# EAGLE design Hatch2023Trophy_1 (EAGLE 9.6.2)

## Sheet 1 of 2
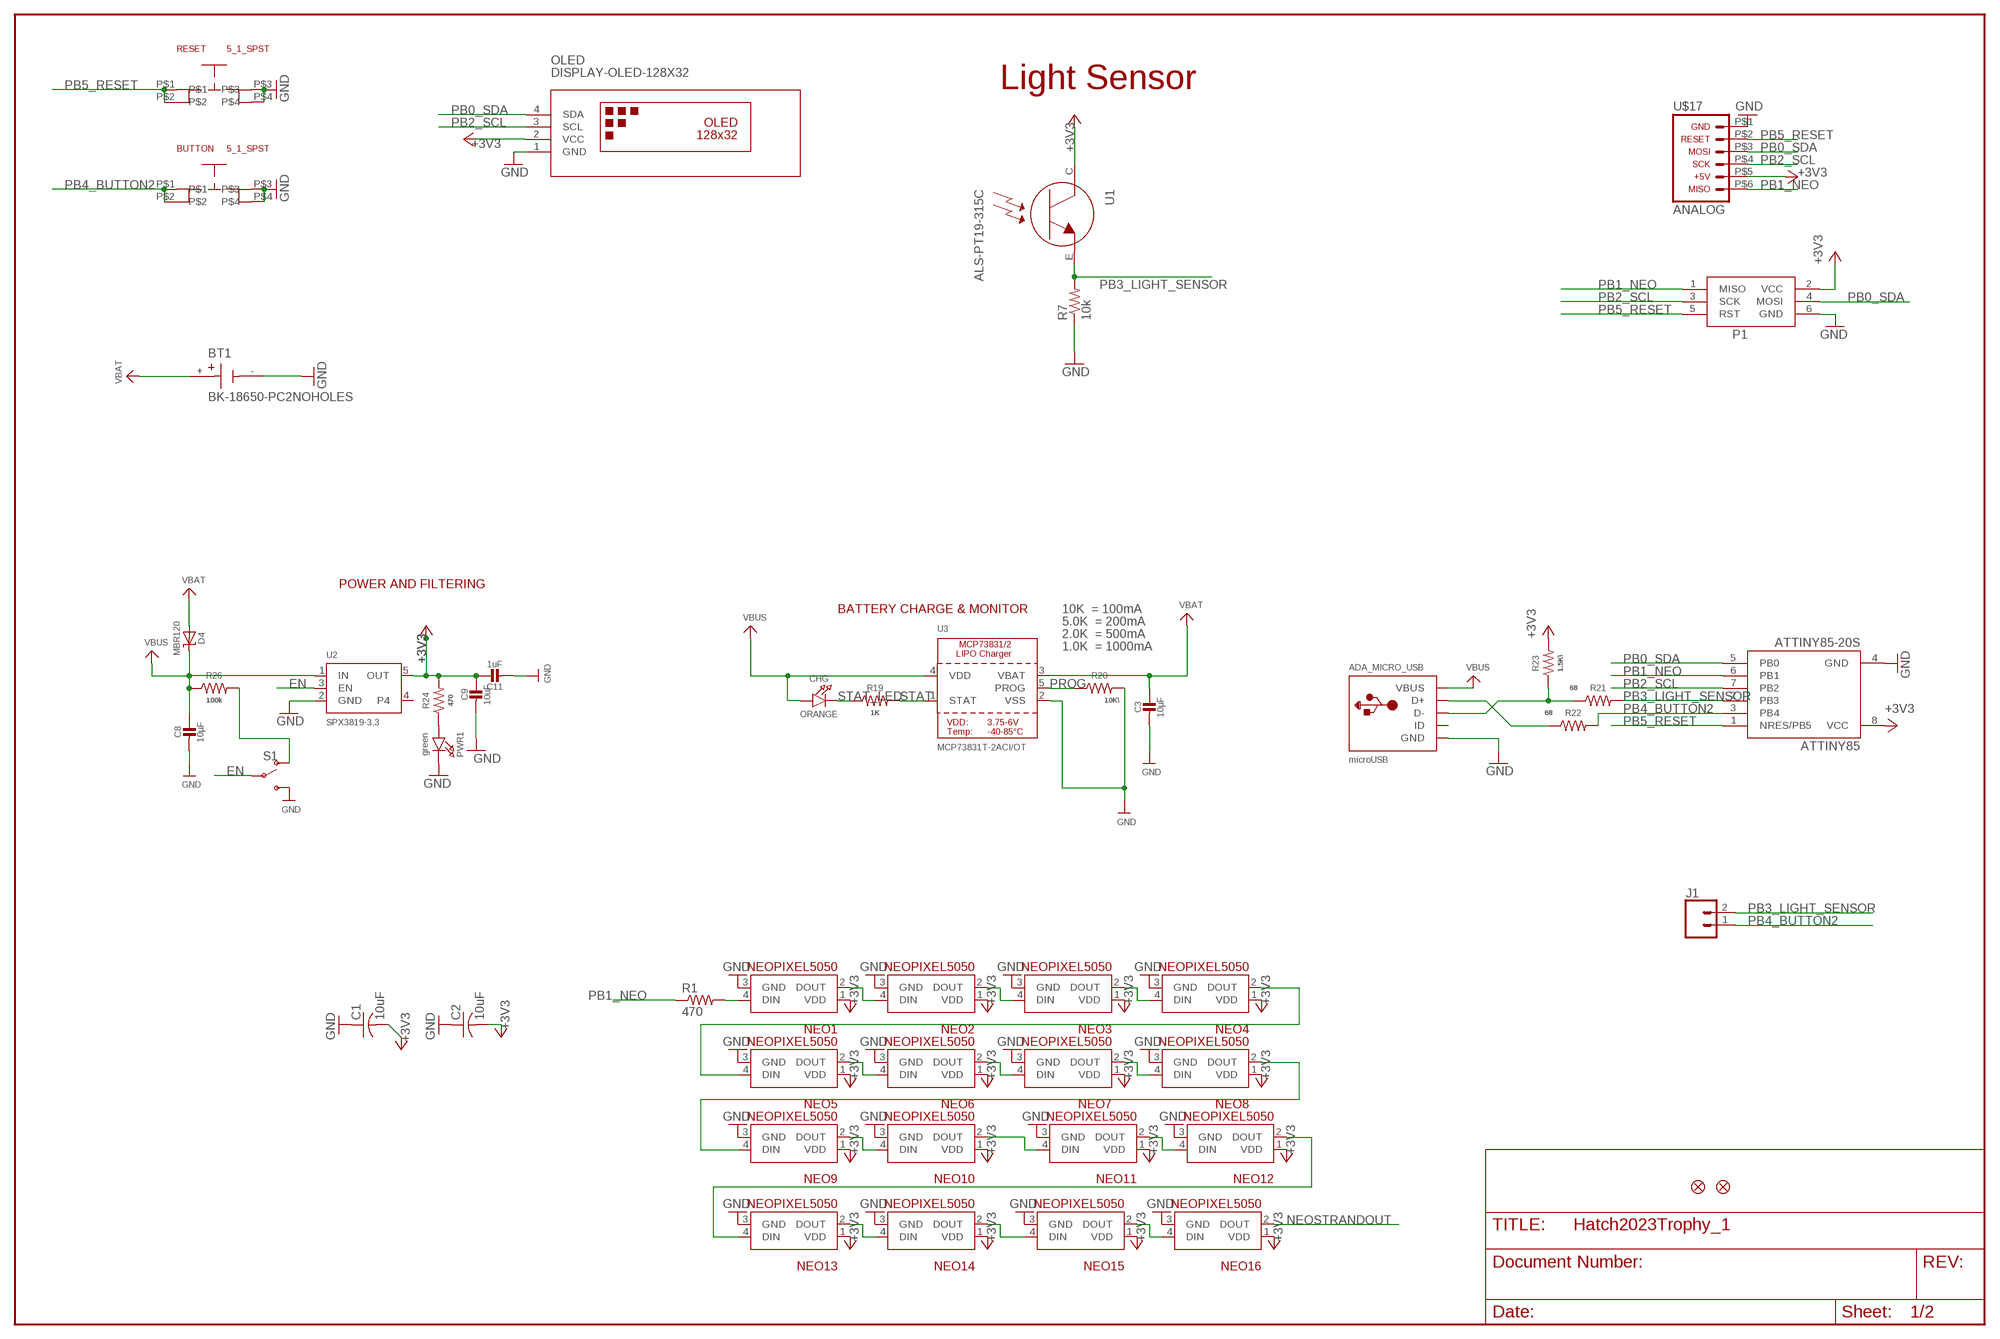
[diagram p0: schematic, sheet 1]

### Parts
ADA_MICRO_USB  microUSB  USB_MICRO_20329_V2  [4UCONN_20329_V2]
ATTINY85  ATTINY85-20S  [SOIC8_EIAJ_208MIL]
BT1  BK-18650-PC2NOHOLES  [BAT_BK-18650-PC2_NOHOLES]
BUTTON  5_1_SPST  [5_1_SPST]
C1  10uF  C-USC0805  [C0805]
C2  10uF  C-USC0805  [C0805]
C3  10µF  CAP_CERAMIC0805-NOOUTLINE  [0805-NO@1]
C8  10µF  CAP_CERAMIC0805-NOOUTLINE  [0805-NO@1]
C9  10uF  CAP_CERAMIC0805-NOOUTLINE  [0805-NO@1]
C11  1uF  CAP_CERAMIC0805-NOOUTLINE  [0805-NO@1]
CHG  ORANGE  LED0805_NOOUTLINE  [CHIPLED_0805_NOOUTLINE]
D4  MBR120  DIODE-SCHOTTKYSOD-123  [SOD-123]
J1  CONN_02  [1X02]
NEO1  NEOPIXEL5050  [NEOPIXEL5050]
NEO2  NEOPIXEL5050  [NEOPIXEL5050]
NEO3  NEOPIXEL5050  [NEOPIXEL5050]
NEO4  NEOPIXEL5050  [NEOPIXEL5050]
NEO5  NEOPIXEL5050  [NEOPIXEL5050]
NEO6  NEOPIXEL5050  [NEOPIXEL5050]
NEO7  NEOPIXEL5050  [NEOPIXEL5050]
NEO8  NEOPIXEL5050  [NEOPIXEL5050]
NEO9  NEOPIXEL5050  [NEOPIXEL5050]
NEO10  NEOPIXEL5050  [NEOPIXEL5050]
NEO11  NEOPIXEL5050  [NEOPIXEL5050]
NEO12  NEOPIXEL5050  [NEOPIXEL5050]
NEO13  NEOPIXEL5050  [NEOPIXEL5050]
NEO14  NEOPIXEL5050  [NEOPIXEL5050]
NEO15  NEOPIXEL5050  [NEOPIXEL5050]
NEO16  NEOPIXEL5050  [NEOPIXEL5050]
OLED  DISPLAY-OLED-128X32  [DISPLAY-OLED-128X32]
P1  AVRISP-6  [AVRISP]
PWR1  green  LED0805_NOOUTLINE  [CHIPLED_0805_NOOUTLINE]
R1  470  R-US_R0805  [R0805]
R7  10k  R-US_R0805  [R0805]
R19  1K  R-US_R0805  [R0805]
R20  10K\  R-US_R0805  [R0805]
R21  68  R-US_R0805  [R0805]
R22  68  R-US_R0805  [R0805]
R23  1.5K\  R-US_R0805  [R0805]
R24  470  R-US_R0805  [R0805]
R26  100k  R-US_R0805  [R0805]
RESET  5_1_SPST  [5_1_SPST]
S1  SWITCH-SPDT-SMD-AYZ0202  [SWITCH_DPDT_SMD_AYZ0202]
U1  ALS-PT19-315C  LIGHT_ALS-PT19-315C  [ALS-PT19-315C]
U2  SPX3819-3.3  VREG_SOT23-5  [SOT23-5]
U3  MCP73831T-2ACI/OT  MCP73831/2  [SOT23-5]
U$17  ICSP_FLATSMD_2X3  [CONN-SMD-2X3]
U$34  FIDUCIAL_1MM  [FIDUCIAL_1MM]
U$35  FIDUCIAL_1MM  [FIDUCIAL_1MM]

### Nets
+3V3 [5V]: ATTINY85.8(VCC) C1.2 C2.2 C9.1 C11.1 NEO1.1(VDD) NEO2.1(VDD) NEO3.1(VDD) NEO4.1(VDD) NEO5.1(VDD) NEO6.1(VDD) NEO7.1(VDD) NEO8.1(VDD) NEO9.1(VDD) NEO10.1(VDD) NEO11.1(VDD) NEO12.1(VDD) NEO13.1(VDD) NEO14.1(VDD) NEO15.1(VDD) NEO16.1(VDD) OLED.2(VCC) P1.2(VCC) R23.2 R24.2 U1.C U2.5(OUT) U$17.P$5
D+: ADA_MICRO_USB.D+ R22.1
D-: ADA_MICRO_USB.D- R21.1 R23.1
EN: S1.2(P) U2.3(EN)
GND [GND]: ADA_MICRO_USB.BASE@1(GND) ADA_MICRO_USB.BASE@2(GND) ADA_MICRO_USB.GND ADA_MICRO_USB.SPRT@1(GND) ADA_MICRO_USB.SPRT@2(GND) ADA_MICRO_USB.SPRT@3(GND) ADA_MICRO_USB.SPRT@4(GND) ATTINY85.4(GND) BT1.- BUTTON.P$3 BUTTON.P$4 C1.1 C2.1 C3.2 C8.2 C9.2 C11.2 NEO1.3(GND) NEO2.3(GND) NEO3.3(GND) NEO4.3(GND) NEO5.3(GND) NEO6.3(GND) NEO7.3(GND) NEO8.3(GND) NEO9.3(GND) NEO10.3(GND) NEO11.3(GND) NEO12.3(GND) NEO13.3(GND) NEO14.3(GND) NEO15.3(GND) NEO16.3(GND) OLED.1(GND) P1.6(GND) PWR1.C R7.1 R20.2 RESET.P$3 RESET.P$4 S1.3(S) U2.2(GND) U3.2(VSS) U$17.P$1
N$1: NEO13.2(DOUT) NEO14.4(DIN)
N$2: NEO11.2(DOUT) NEO12.4(DIN)
N$3: NEO12.2(DOUT) NEO13.4(DIN)
N$4: NEO14.2(DOUT) NEO15.4(DIN)
N$5: NEO15.2(DOUT) NEO16.4(DIN)
N$8: NEO4.2(DOUT) NEO5.4(DIN)
N$9: PWR1.A R24.1
N$11: R26.2 S1.1(O)
N$12: NEO1.4(DIN) R1.2
N$13: NEO8.2(DOUT) NEO9.4(DIN)
N$18: NEO1.2(DOUT) NEO2.4(DIN)
N$20: NEO2.2(DOUT) NEO3.4(DIN)
N$21: NEO3.2(DOUT) NEO4.4(DIN)
N$23: NEO5.2(DOUT) NEO6.4(DIN)
N$24: NEO6.2(DOUT) NEO7.4(DIN)
N$25: NEO7.2(DOUT) NEO8.4(DIN)
N$27: NEO9.2(DOUT) NEO10.4(DIN)
N$28: NEO10.2(DOUT) NEO11.4(DIN)
NEOSTRANDOUT: NEO16.2(DOUT)
PB0_SDA: ATTINY85.5(PB0) OLED.4(SDA) P1.4(MOSI) U$17.P$3
PB1_NEO: ATTINY85.6(PB1) P1.1(MISO) R1.1 U$17.P$6
PB2_SCL: ATTINY85.7(PB2) OLED.3(SCL) P1.3(SCK) U$17.P$4
PB3_LIGHT_SENSOR: ATTINY85.2(PB3) J1.2 R7.2 R21.2 U1.E
PB4_BUTTON2: ATTINY85.3(PB4) BUTTON.P$1 BUTTON.P$2 J1.1 R22.2
PB5_RESET: ATTINY85.1(NRES/PB5) P1.5(RST) RESET.P$1 RESET.P$2 U$17.P$2
PROG: R20.1 U3.5(PROG)
STAT: R19.2 U3.1(STAT)
STAT_LED: CHG.C R19.1
VBAT [PWR]: BT1.+ C3.1 D4.A U3.3(VBAT)
VBUS [5V]: ADA_MICRO_USB.VBUS C8.1 CHG.A D4.C R26.1 U2.1(IN) U3.4(VDD)
Unconnected: ADA_MICRO_USB.ID U2.4

### Notes on the sheet
- Light Sensor
- POWER AND FILTERING
- BATTERY CHARGE & MONITOR | 10K  = 100mA
- 5.0K  = 200mA
- 2.0K  = 500mA
- 1.0K  = 1000mA

## Sheet 2 of 2

## Library data of the parts
ADA_MICRO_USB = microbuilder:USB: USB Connectors USBMINIB - Surface Mount Female Mini-B USB Connector 4UConnector: 06564
ATTINY85 = attiny25_45_85:ATTINY85*: ATMEL ATtiny 85 Packages: P = PDIP 08 30mil S = SOIC 08 EIAJ 208mil Technologies Note: for complete ordering code (temp. range, finish, tape&reel etc.) see www.atmel.com • Supply Voltage: V = (1.8…5.5)V | [blank] = (2.7…5.5)V • Speed: 10 = 10 MHz | 20 = 20 MHz Author: Dipl.-Ing. FH Rainer Bayer HHN Hochschule Heilbronn (Heilbronn University), rainer.bayer@hs-heilbronn.de Ingenieurbüro ing-rb, mail@ing-rb.de
BT1 = BK-18650-PC2:BK-18650-PC2: Battery Holder (Open) 18650 1 Cell PC Pin Check prices <https://pricing.snapeda.com/parts/BK-18650-PC2/MPD%20%28Memory%20Protection%20Devices%29/view-part?ref=eda>
BUTTON RESET = TrophyParts:5_1_SPST
C1 C2 = rcl:C-US: CAPACITOR, American symbol; SPICEPREFIX: C
C3 C8 C9 C11 = microbuilder:CAP_CERAMIC: Ceramic Capacitors For new designs, use the packages preceded by an '_' character since they are more reliable: The following footprints should be used on most boards: _0402 - Standard footprint for regular board layouts _0603 - Standard footprint for regular board layouts _0805 - Standard footprint for regular board layouts _1206 - Standard footprint for regular board layouts For extremely tight-pitch boards where space is at a premium, the following 'micro-pitch' footprints can be used (smaller pads, no silkscreen outline, etc.): _0402MP - Micro-pitch footprint for very dense/compact boards _0603MP - Micro-pitch footprint for very dense/compact boards _0805MP - Micro-pitch footprint for very dense/compact boards _1206MP - Micro-pitch footprint for very dense/compact boards
CHG PWR1 = microbuilder:LED: LED 0603 - 0603 Surface Mount Package 2mA: Green LED - Low Power (3.9mcd, 2ma, 1.7Vf) - Digikey: 475-2709-2-ND Orange LED - Low Power (9.8mcd, 2ma, 1.8Vf) - Digikey: 475-1194-2-ND Red LED - Low Power (5mcd, 2ma, 1.8Vf) - Digikey: 475-1195-2-ND Yellow LED - Low Power (7mcd, 2ma, 1.8Vf) - Digikey: 475-1196-2-ND 5mA: Blue LED - Low Power (17mcd, 5ma, 2.9Vf) - Digikey: LNJ937W8CRACT-ND 0805 - 0805 Surface Mount Package 2mA: Red LED (8.8mcd, 2mA, 1.8Vf, Clear) - Low Power [Digikey: 475-2510-1-ND] Green LED (5mcd, 2mA, 1.8Vf, Clear) - Low Power [Digikey: 475-2730-1-ND] Yellow LED (11.3mcd, 2mA, 1.8Vf, Clear) - Low Power [Digikey: 475-2555-1-ND] 20mA: Red LED (104mcd, 20mA, Diffused) - LS R976 [Digikey: 475-1278-6-ND] Red LED (12mcd, 20mA, 2.0Vf, Clear) - APT2012EC [Digikey: 754-1128-1-ND] Green LED (15mcd, 20mA, 2.2Vf, Clear) - APT2012GC [Digikey: 754-1131-1-ND] Orange LED (160mcd, 20mA, 2.1Vf, Clear) - APT2012SECK [Digikey: 754-1130-1-ND] 1206 - 1206 Surface Mount Package Green LED (26mcd, 20mA, Diffused) - LG N971 [Digikey: 475-1407-6-ND] Red LED (15mcd, 20mA, Diffused) - LH N974 [Digikey: 475-1416-6-ND] Cree - Cree High-Power Surface Mount LEDs XPEBWT-L1-0000-00D50 - White 111lm 350mA 2.9Vf 6200K 110° XTEAWT-00-0000-00000LEE3 - White 114lm 350mA 2.85Vf 5000K 115° Everlight - Everlight 45-21 Series Surface Mount LEDs 45-21/QK2C-B2832AC2CB2/2T - Warm White 2000mcd 20mA 3.25Vf 3050K 120° 45-21/LK2C-B38452C4CB2/2T - Nuetral White 2000mcd 20mA 3.25Vf 4150K 120° 45-21/LK2C-B50634C6CB2/2T - Cold White 2200mcd 20mA 3.25Vf 5650K 120° PLCC2 Reverse Mount LS T77K-J1L2-1-0-2-R18-Z - Red 11.25mcd 2mA 1.8Vf 630nm 120° LO T77K-L1M2-24-Z - Orange 19.6mcd 2mA 1.8Vf 606nm 120° LY T77K-K2M1-26-Z - Yellow 15.7mcd 2mA 1.8Vf 587nm 120°
D4 = microbuilder:DIODE-SCHOTTKY
J1 = SparkFun-Connectors:CONN_02: Multi connection point. Often used as Generic Header-pin footprint for 0.1 inch spaced/style header connections On any of the 0.1 inch spaced packages, you can populate with these: Break Away Headers - Straight <https://www.sparkfun.com/products/116> (PRT-00116) Break Away Male Headers - Right Angle <https://www.sparkfun.com/products/553> (PRT-00553) Female Headers <https://www.sparkfun.com/products/115> (PRT-00115) Break Away Headers - Machine Pin <https://www.sparkfun.com/products/117> (PRT-00117) Break Away Female Headers - Swiss Machine Pin <https://www.sparkfun.com/products/743> (PRT-00743) For SCREWTERMINALS and SPRING TERMINALS visit here: Screw Terimnals on SparkFun.com <https://www.sparkfun.com/search/results?term=Screw+Terminals> (5mm/3.5mm/2.54mm spacing) This device is also useful as a general connection point to wire up your design to another part of your project. Our various solder wires solder well into these plated through hole pads. Hook-Up Wire - Assortment (Stranded, 22 AWG) <https://www.sparkfun.com/products/11375> (PRT-11375) Hook-Up Wire - Assortment (Solid Core, 22 AWG) <https://www.sparkfun.com/products/11367> (PRT-11367) View the entire wire category on our website here <https://www.sparkfun.com/categories/141> Special notes: Molex polarized connector foot print use with: PRT-08233 with associated crimp pins and housings. 2.54_SCREWTERM for use with PRT-10571. 3.5mm Screw Terminal footprints for PRT-08084 5mm Screw Terminal footprints for use with PRT-08432
NEO1-NEO16 = TrophyParts:NEOPIXEL5050
OLED = Hatch2020:DISPLAY-OLED-128X32: 128x32 Dot Matrix OLED Module with I2C interface based on SSD1306 chip More details available here: http://www.tinyosshop.com/index.php?route=product/product&product_id=953 Schematic available here: http://www.tinyosshop.com/datasheet/OLED%2012832.pdf SSD1306 datasheet: https://cdn-shop.adafruit.com/datasheets/SSD1306.pdf Click here to find device on ebay.com <http://www.ebay.com/sch/oled+display+128x32+i2c>
P1 = adafruit:AVRISP: AVR ISP HEADER Standard 6 pin header for AVR programming
R1 R7 R19-R24 R26 = rcl:R-US_: RESISTOR, American symbol; SPICEPREFIX: R
S1 = SparkFun-Switches:SWITCH-SPDT: Single Pole, Double Throw (SPDT) Switch Single-pole, double-throw (SPDT) switch. Variant Overview SMD-AYZ0202 Surface Mount DPDT Switch <https://www.sparkfun.com/products/597> (COM-00597) Used on e.g. LilyPad Arduino USB - ATmega32U4 Board <https://www.sparkfun.com/products/12049> PTH-11.6X4.0MM SPDT Mini Power Switch <https://www.sparkfun.com/products/102> (COM-00102) Used on e.g. SparkFun Simon Says - Through-Hole Soldering Kit <https://www.sparkfun.com/products/10547> (KIT-10547) PTH-11.6X4.0MM-KIT KIT version of SPDT Mini Power Switch - Simplifies soldering by removing tStop of switch pins - only one side can be soldered. PTH-11.6X4.0MM-LOCK LOCK version of SPDT Mini Power Switch - Offset pins hold switch in place for easier soldering. SMD-RIGHT-ANGLE Surface Mount Right Angle Switch <https://www.sparkfun.com/products/10860> (COM-10860) Used on e.g. SparkFun ESP8266 Thing <https://www.sparkfun.com/products/13231>; PROD_ID: SWCH-08179; SF_ID: COM-00597
U1 = microbuilder:LIGHT_ALS-PT19-315C: ALS-PT19-315C - Analog Light Sensor VCC: 2.5-5.5V
U2 = microbuilder:VREG_SOT23-5: SOT23-5 Fixed Voltage Regulators Part Current Out V Out V In V Dropout θJA (°C/W) TJ (°C) Digikey Part No. ADP121 150mA 3.3V 3.4-5.5V 0.09V @ 150mA -- -- ADP121-AUJZ33R7CT-ND ADP121 150mA 3.0V 3.1-5.5V 0.09V @ 150mA -- -- ADP121-AUJZ30R7CT-ND ADP122 300mA 3.3V 3.4-5.5V 0.085V @ 300mA -- -- ADP122AUJZ-3.3-R7CT-ND ADP1712 300mA 3.3V 3.5-5.5V 0.17V @ 300mA -- -- ADP1712AUJZ-3.3-R7TR-ND AP7311 (Low Cost) 150mA 3.3V 3.5-6V 0.15V @ 150mA -- -- AP7311-33WG-7DICT-ND LD39015M18R 150mA 1.8V 1.9V-5.5V 0.08V @ 100mA -- -- 497-6977-1-ND LP2985A-33DBVR 150mA 3.3V 3.3-16V 0.28V @ 150mA 206 150 296-18479-1-ND MCP1824T-3302E/OT 300mA 3.3V 3.5V-6V 0.2V @ 300mA -- -- MCP1824T-3302E/OTCT-ND MIC5205-2.5YM5 TR 150mA 2.5V 2.7-16V 0.165V @ 150mA -- -- 576-1257-2-ND MIC5205-3.0YM5 TR 150mA 3.0V 3.2V-16V 0.165V @ 150mA -- -- 576-1258-2-ND MIC5205-3.3YM5 TR 150mA 3.3V 3.5V-16V 0.165V @ 150mA -- -- 576-1259-2-ND TPS780330220 150mA 3.3V+2.2V 3.6-5.5V 250mV Max -- -- 296-23332-1-ND TDA3663/N1,135 100mA 3.3V 3.5-45V 0.18V @ 50mA -- -- 568-5343-1-ND Max operating temp can be calculated using θJA, TJ (max junction temperature), and power in watts. Set the "Maximum Ambient Temperature" until it reaches TJ ("Max Junction Temperature"), which is the absolute limit for safe use of the regulator: Heat Sink Temperature Calculator <http://www.daycounter.com/Calculators/Heat-Sink-Temperature-Calculator.phtml> For example, With 12V source into a 3.3V LP2985 and a 30mA load, we are dissipating (12V-3.3V) * 0.03A = 0.261W. With a θJA of 206 °C/W, a TJ of 150°C, and 261mW we can safely use the chip without a heat sink up to 75°C (=147.1°C Junction Temperature).
U3 = microbuilder:MCP73831/2: MCP73831/2 LIPO Charger VDD: 3.75 - 6V Temp -40 - 85°C Programmable Charge Rate: 15-500mA NOTE: STAT is a tri-state logic output on the MCP73831 and an open-drain output on the MCP73832. SOT23-5 with 4.2V output and tri-state logic on STAT = MCP73831T-2ACI/OT
U$17 = TrophyParts:ICSP_FLAT
U$34 U$35 = microbuilder:FIDUCIAL: Fiducial Alignment Points Various fiducial points for machine vision alignment.; BOM: EXCLUDE

## Net classes
0 default: width 0.152 mm
1 PWR: width 0.508 mm
2 5V: width 0.508 mm
3 GND: width 0.254 mm

## Board
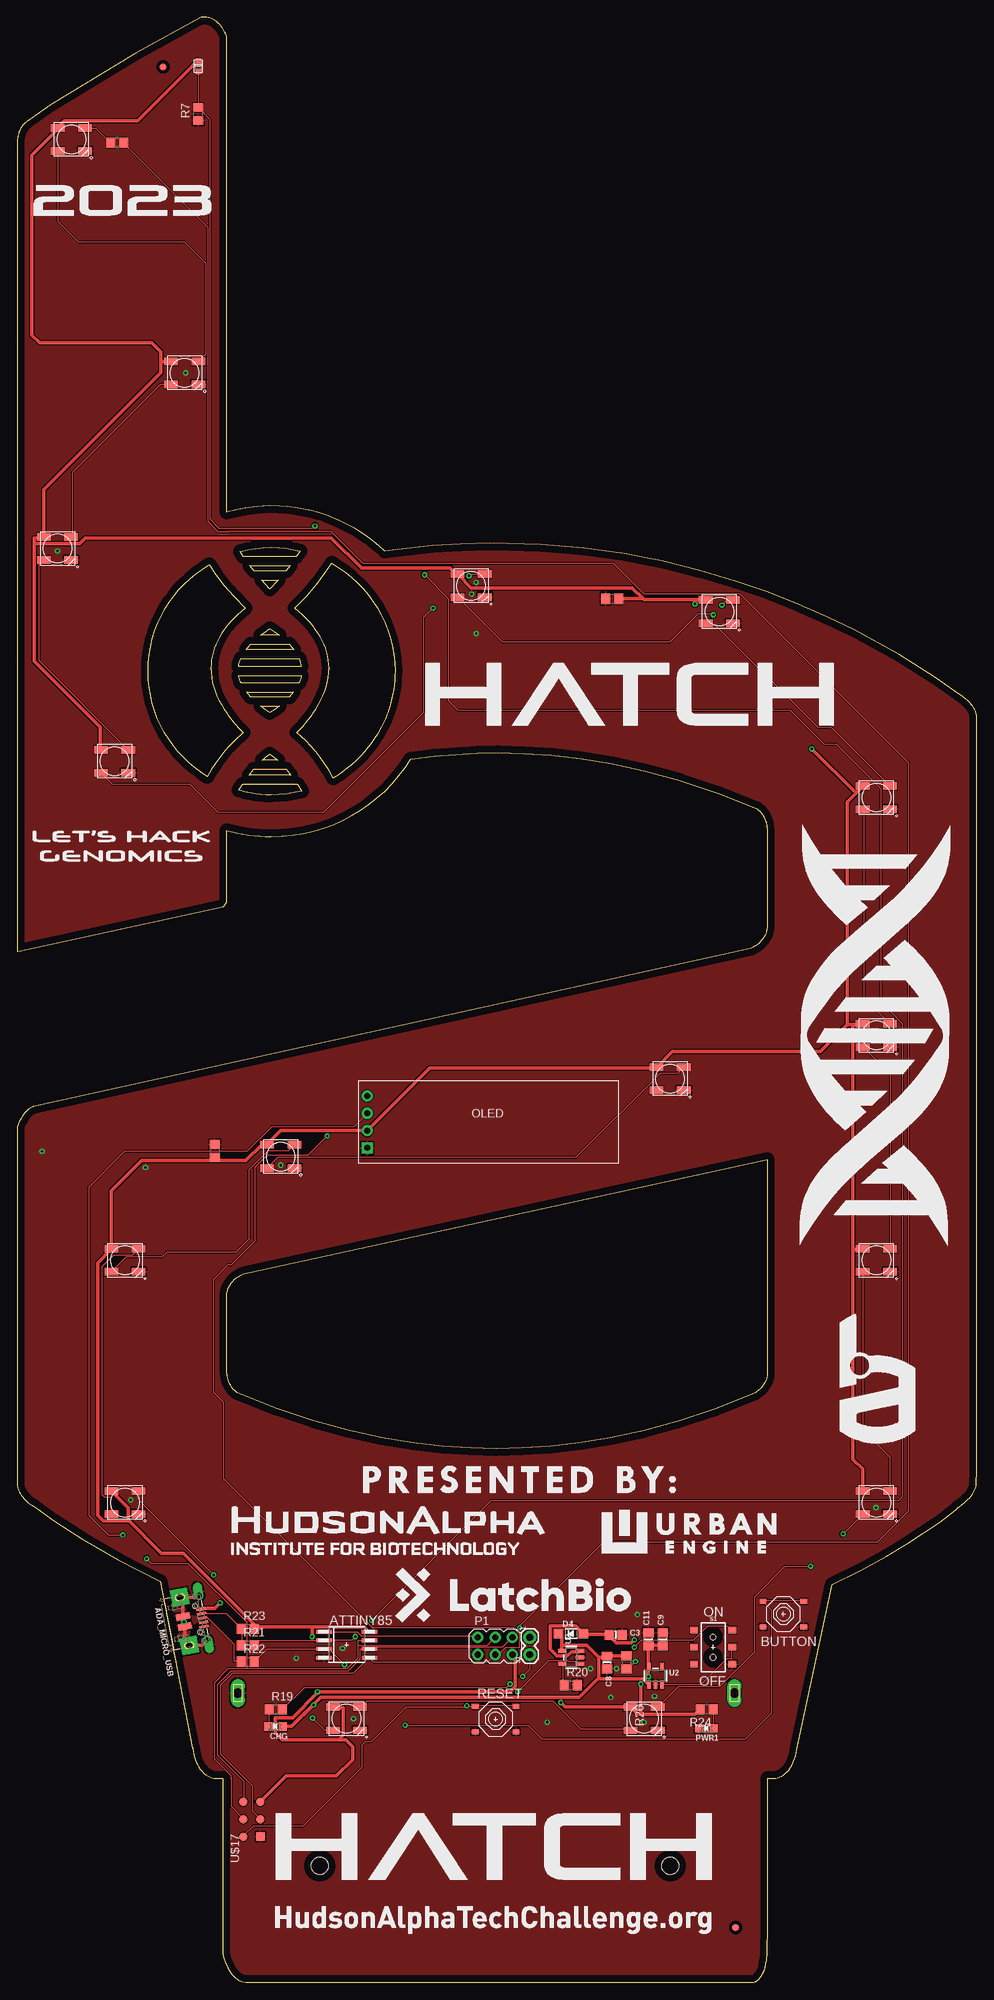
[diagram p1: board, top side]
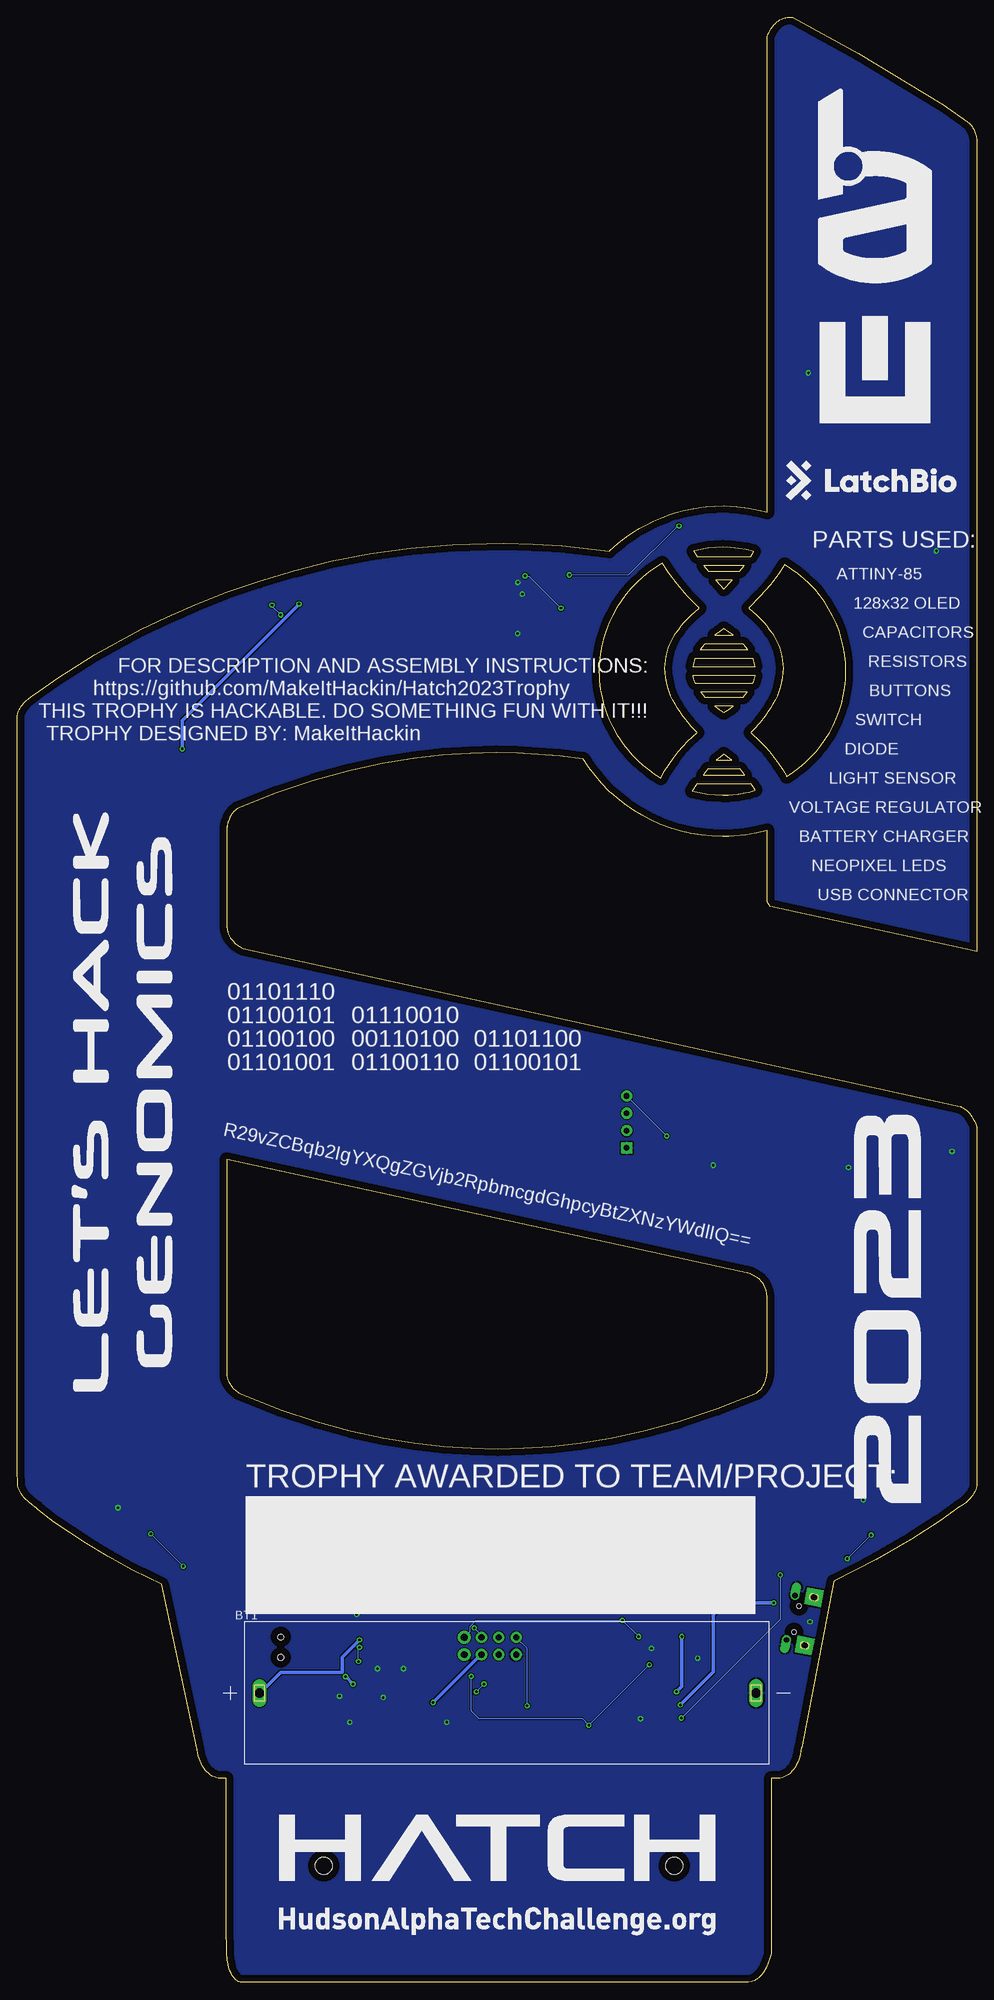
[diagram p2: board, bottom side, seen from below]

Size 140.9 x 288.58 mm. Coordinates in mm from the lower left corner, seen from the top.
Outline: 138.35,189.11 134.71,191.68 129.49,194.95 122.8,198.61 118.93,200.48 114.72,202.33 110.2,204.12 105.36,205.79 100.23,207.32 94.82,208.66 89.13,209.77 83.18,210.62 76.98,211.15 69.45,211.33 65.15,211.21 60.97,210.95 53.97,210.18 53.14,210.93 52.28,211.64 51.38,212.32 50.45,212.95 49.48,213.54 48.49,214.09 47.48,214.59 46.43,215.04 45.36,215.45 44.27,215.81 43.16,216.11 42.02,216.37 40.87,216.56 39.7,216.71 38.51,216.8 37.07,216.82 36.14,216.79 35.23,216.71 33.48,216.48 32.02,216.2 30.77,215.89 30.81,285.69 30.81,285.69 30.81,285.69 30.79,285.73 30.77,285.75 30.77,285.76 30.7,285.94 30.61,286.14 30.5,286.38 30.35,286.66 30.17,286.95 30.07,287.1 29.96,287.24 29.85,287.38 29.73,287.51 29.61,287.63 29.48,287.75 29.35,287.86 29.21,287.97 29.07,288.07 28.91,288.16 28.75,288.25 28.59,288.33 28.41,288.4 28.23,288.46 28.05,288.51 27.85,288.55 27.65,288.57 27.45,288.58 27.23,288.58 27.01,288.56 17.4,283.24 4.95,275.69 1.4,273.24 1.2,273.06 1.02,272.88 0.85,272.68 0.71,272.48 0.58,272.28 0.47,272.07 0.37,271.87 0.29,271.67 0.22,271.47 0.16,271.28 0.11,271.1 0.07,270.93 0.02,270.62 0,270.38 0.02,151.34 30.36,157.97 30.77,158.62 30.77,169.15 32.35,168.76 33.97,168.48 35.62,168.3 36.46,168.26 37.3,168.25 38.91,168.3 40.49,168.46 42.04,168.71 43.55,169.06 45.03,169.51 46.46,170.05 47.85,170.67 49.19,171.38 50.48,172.16 51.72,173.03 52.9,173.96 54.02,174.97 55.07,176.04 56.06,177.18 56.97,178.37 57.82,179.63 61.21,180.05 67.57,180.51 70.54,180.58 74.35,180.47 78.41,180.19 82.73,179.7 87.32,178.94 92.2,177.87 97.36,176.44 102.82,174.62 108.59,172.34 108.75,172.22 108.89,172.1 109.02,171.98 109.14,171.85 109.25,171.72 109.36,171.58 109.45,171.44 109.59,171.21 109.64,171.12 109.69,171.03 109.77,170.84 109.9,170.46 109.92,170.42 109.95,170.36 109.99,170.2 110.02,170.03 110.04,169.87 110.06,169.73 110.06,169.72 110.06,169.72 110.06,169.71 110.06,169.71 110.06,169.71 110.07,169.7 110.07,169.7 110.07,169.7 110.07,169.7 110.07,169.7 110.08,169.7 110.08,169.69 110.08,169.69 110.08,169.69 110.08,169.69 110.13,169.19 110.13,169.14 110.13,169.01 110.13,168.99 110.13,168.98 110.13,168.98 110.13,168.97 110.12,168.97 110.12,168.96 110.12,168.96 110.12,168.95 110.11,168.95 110.11,168.88 110.13,168.88 110.13,154.96 110.08,154.59 109.99,154.24 109.88,153.92 109.74,153.62 109.57,153.35 109.39,153.11 109.19,152.88 108.99,152.68 108.78,152.5 108.57,152.35 108.37,152.21 108.18,152.09 108,151.99 107.83,151.91 107.69,151.85 2.46,128.65 2.35,128.63 2.31,128.58 2.02,128.43 1.75,128.25 1.51,128.05 1.28,127.83 1.08,127.6 0.9,127.37 0.73,127.12 0.58,126.89 0.45,126.65 0.34,126.43 0.17,126.04 0,125.6 0,73.24 0.02,72.92 0.08,72.62 0.17,72.33 0.3,72.05 0.45,71.78 0.62,71.52 0.81,71.28 1.01,71.05 1.23,70.83 1.44,70.64 1.66,70.45 2.07,70.14 2.42,69.91 2.57,69.82 5.54,67.7 9.65,65.04 14.84,62.03 21.05,58.88 25.69,34.44 25.8,34.44 25.85,33.98 25.93,33.53 26.03,33.1 26.16,32.69 26.32,32.29 26.5,31.93 26.7,31.58 26.91,31.27 27.15,30.98 27.41,30.73 27.68,30.51 27.97,30.32 28.27,30.18 28.58,30.07 28.9,30 29.23,29.98 29.57,29.98 29.57,29.96 30.18,29.96 30.19,8.31 30.21,8.31 30.22,4.22 30.38,3.59 30.6,2.94 30.93,2.19 31.14,1.81 31.38,1.43 31.65,1.07 31.96,0.75 32.3,0.47 32.69,0.24 33.11,0.08 33.58,0 107.98,0 107.98,0 107.99,0 107.99,0 107.99,0 108,0 108,0 108,0 108.01,0 108.03,0.01 108.03,0.01 108.05,0.01 108.06,0.01 108.06,0.01 108.15,0.03 108.15,0.03 108.27,0.07 108.42,0.14 108.58,0.23 108.75,0.36 108.94,0.53 109.12,0.74 109.31,1.01 109.48,1.33 109.65,1.72 109.8,2.17 109.92,2.7 110.02,3.31 110.1,4.27 110.17,8.31 110.18,8.31 110.16,29.96 110.95,29.96 110.95,29.98 111.03,29.98 111.35,30 111.66,30.06 111.96,30.16 112.25,30.3 112.53,30.47 112.79,30.68 113.04,30.92 113.28,31.19 113.49,31.48 113.69,31.8 113.87,32.15 114.03,32.52 114.17,32.91 114.28,33.32 114.37,33.74 114.43,34.18 114.45,34.18 119.67,58.43 123.89,60.52 127.58,62.54 130.75,64.44 135.43,67.59 137.81,69.42 138.11,69.67 138.11,69.72 138.2,69.77 138.32,69.86 138.68,70.12 139.11,70.48 139.35,70.7 139.59,70.93 139.82,71.19 140.05,71.45 140.26,71.73 140.44,72.01 140.6,72.3 140.72,72.59 140.8,72.88 140.83,73.17 140.9,75.17 140.9,185.71 140.89,186.01 140.83,186.31 140.73,186.61 140.61,186.88 140.46,187.15 140.29,187.41 140.1,187.65 139.89,187.88 139.68,188.09 139.47,188.29 139.25,188.47 138.85,188.79 138.5,189.02 138.35,189.11
Outline: 37.3,210.72 38.4,210.68 39.47,210.58 40.53,210.42 41.57,210.2 41.02,209.34 33.24,209.34 32.73,210.12 33.84,210.37 34.97,210.56 36.13,210.68 37.3,210.72
Outline: 37.13,186.42 36.43,186.9 35.79,187.38 38.47,187.38 37.82,186.9 37.13,186.42
Outline: 38.28,179.46 35.98,179.46 36.26,179.71 36.54,179.95 36.83,180.17 37.13,180.37 37.42,180.17 37.71,179.95 37.99,179.71 38.28,179.46
Outline: 39.52,178.14 40.19,177.3 34.06,177.3 34.73,178.14 39.52,178.14
Outline: 39.93,188.7 34.32,188.7 33.99,189.07 33.69,189.43 40.56,189.43 40.26,189.07 39.93,188.7
Outline: 32.89,190.75 32.77,191.03 32.67,191.32 32.59,191.6 32.56,191.74 32.53,191.88 41.72,191.88 41.69,191.74 41.62,191.46 41.54,191.17 41.43,190.89 41.37,190.75 32.89,190.75
Outline: 32.52,193.2 32.58,193.5 32.65,193.8 32.75,194.08 32.86,194.37 41.39,194.37 41.51,194.08 41.6,193.8 41.68,193.5 41.73,193.2 32.52,193.2
Outline: 33.64,195.69 33.96,196.1 34.31,196.48 39.95,196.48 40.29,196.1 40.61,195.69 33.64,195.69
Outline: 37.13,198.76 37.74,198.35 38.49,197.81 35.77,197.81 36.51,198.35 37.13,198.76
Outline: 35.92,205.88 38.33,205.88 37.13,204.61 35.92,205.88
Outline: 34.8,207.2 34.17,208.02 40.08,208.02 39.45,207.2 34.8,207.2
Outline: 19.23,192.51 19.27,193.76 19.4,194.98 19.6,196.17 19.88,197.34 20.24,198.47 20.66,199.57 21.16,200.64 21.72,201.67 22.34,202.65 23.02,203.59 23.76,204.49 24.55,205.33 25.4,206.13 26.29,206.87 27.23,207.55 28.22,208.17 29.17,206.74 30.36,205.19 31.79,203.53 33.51,201.77 32.9,201.27 32.34,200.76 31.81,200.25 31.32,199.73 30.87,199.2 30.45,198.67 30.08,198.13 29.74,197.58 29.45,197.03 29.19,196.48 28.97,195.91 28.79,195.34 28.65,194.77 28.54,194.19 28.48,193.61 28.46,193.02 28.48,192.3 28.56,191.59 28.69,190.9 28.87,190.22 29.09,189.55 29.34,188.91 29.64,188.28 29.96,187.67 30.31,187.08 30.69,186.51 31.08,185.95 31.91,184.92 32.76,183.98 33.19,183.54 31.86,182.29 31.18,181.58 30.5,180.8 29.82,179.96 29.16,179.06 28.52,178.1 27.93,177.08 26.97,177.71 26.06,178.4 25.2,179.14 24.38,179.92 23.61,180.76 22.9,181.65 22.24,182.57 21.64,183.54 21.1,184.55 20.62,185.6 20.21,186.68 19.86,187.79 19.59,188.93 19.39,190.1 19.27,191.29 19.23,192.51
Outline: 34.3,174.63 33.41,174.82 32.54,175.05 33.13,175.98 41.12,175.98 41.77,174.94 40.69,174.7 39.58,174.52 38.45,174.41 37.3,174.36 36.54,174.38 35.78,174.43 35.04,174.51 34.3,174.63
Outline: 52.53,182.71 51.92,181.83 51.27,180.99 50.57,180.19 49.82,179.44 49.04,178.73 48.21,178.06 47.34,177.44 46.44,176.88 45.83,177.93 45.19,178.92 44.52,179.85 43.82,180.72 43.12,181.52 42.42,182.26 41.73,182.94 41.07,183.55 41.92,184.44 42.76,185.43 43.17,185.96 43.56,186.51 43.94,187.08 44.29,187.67 44.62,188.28 44.91,188.91 45.17,189.55 45.39,190.22 45.56,190.9 45.69,191.59 45.77,192.3 45.8,193.02 45.77,193.61 45.71,194.19 45.61,194.77 45.47,195.34 45.28,195.91 45.07,196.48 44.81,197.03 44.51,197.58 44.17,198.13 43.8,198.67 43.39,199.2 42.94,199.73 42.45,200.25 41.92,200.76 41.35,201.27 40.75,201.77 42.52,203.59 44,205.31 45.21,206.91 46.17,208.38 47.19,207.77 48.16,207.09 49.08,206.35 49.96,205.55 50.78,204.7 51.54,203.8 52.25,202.85 52.89,201.85 53.47,200.81 53.98,199.72 54.42,198.6 54.79,197.45 55.09,196.26 55.3,195.04 55.44,193.8 55.49,192.53 55.47,191.86 55.43,191.18 55.36,190.52 55.27,189.86 55.16,189.22 55.03,188.58 54.87,187.94 54.69,187.32 54.49,186.71 54.03,185.51 53.48,184.35 52.86,183.24 52.53,182.71
Outline: 110.13,89.76 110.13,89.41 110.1,89.08 110.04,88.77 109.95,88.48 109.84,88.21 109.71,87.96 109.57,87.72 109.41,87.51 109.24,87.31 109.06,87.14 108.88,86.97 108.7,86.83 108.52,86.7 108.34,86.59 108.17,86.49 108.01,86.41 102.36,84.18 97,82.39 91.92,81 87.11,79.96 82.56,79.22 78.26,78.73 74.2,78.46 70.36,78.34 66.55,78.46 62.5,78.74 58.18,79.24 53.58,79.99 48.71,81.06 43.55,82.48 38.09,84.31 32.32,86.59 32.02,86.82 31.76,87.08 31.55,87.35 31.36,87.63 31.21,87.92 31.09,88.21 30.99,88.5 30.92,88.77 30.86,89.04 30.82,89.28 30.8,89.5 30.79,89.69 30.78,89.96 30.79,90.07 30.77,90.07 30.77,100.68 30.79,100.68 30.82,101.16 30.9,101.61 31.04,102 31.21,102.36 31.42,102.68 31.65,102.96 31.9,103.21 32.17,103.43 32.43,103.61 32.7,103.77 32.95,103.9 33.18,104 33.39,104.08 33.7,104.18 33.79,104.21 110.13,120.87 110.13,89.76
Copper layers (1*16): Top 0.035mm / dielectric 1.5mm / Bottom 0.035mm
Design rules "default *": minimum track width 6mil, minimum drill 0.35mm, track to track 6mil, track to pad 6mil, pad to pad 6mil, via to via 6mil, smd to smd 6mil, copper to edge 40mil, drill to drill 6mil, minimum pad ring 10mil, minimum via ring 8mil, stop-mask expansion 4mil, vias tented up to drill 15mil, thermal gap 10mil
Holes 2.54 mm at 44.43,17.13 95.86,17.13

### Footprints (pad centres in the part's own frame; a part is rotated, then mirrored left to right if it is on the bottom)
4UCONN_20329_V2 = smd 1 x 2: BASE@1 -0.75,-2; BASE@2 0.75,-2 | smd 0.4 x 1.35: D+ 0,0.775; D- -0.65,0.775; GND 1.3,0.775; ID 0.65,0.775; VBUS -1.3,0.775 | drill 0.8 pad 1.2 offset: SPRT@1 -3.3,0.9; SPRT@2 3.3,0.9 | drill 0.9 pad 2.5 square: SPRT@3 -3.6,-1.9; SPRT@4 3.6,-1.9 | hole 0.7: -1.95,0; 1.95,0
SOIC8_EIAJ_208MIL = smd 0.6 x 2.286: 1 -1.905,-3.33; 2 -0.635,-3.33; 3 0.635,-3.33; 4 1.905,-3.33; 5 1.905,3.33; 6 0.635,3.33; 7 -0.635,3.33; 8 -1.905,3.33
BAT_BK-18650-PC2_NOHOLES = drill 1.38 long: + -35.03,0; - 37.87,0
5_1_SPST = smd 1 x 0.75: P$1 -3,1.875; P$2 3,1.875; P$3 -3,-1.875; P$4 3,-1.875
C0805 = smd 1.3 x 1.5: 1 -0.95,0; 2 0.95,0
0805-NO@1 = smd 1.3 x 1.5: 1 -0.95,0; 2 0.95,0
CHIPLED_0805_NOOUTLINE = smd 1.2 x 1.2: A 0,-1.05; C 0,1.05
SOD-123 = smd 1.4 x 1.4: A 1.85,0; C -1.85,0
1X02 = drill 1.016 pad 1.88: 1 0,0; 2 2.54,0
NEOPIXEL5050 = smd 2 x 1.1: 1 -2,1.7; 2 -2,-1.7; 3 2,-1.7; 4 2,1.7
DISPLAY-OLED-128X32 = drill 0.813 pad 1.651 square: 1 -17.78,-3.81 | drill 0.813 pad 1.651: 2 -17.78,-1.27; 3 -17.78,1.27; 4 -17.78,3.81
AVRISP = drill 0.9 pad 1.626: 1 -1.27,2.54; 2 1.27,2.54; 3 -1.27,0; 4 1.27,0; 5 -1.27,-2.54; 6 1.27,-2.54
R0805 = smd 1.3 x 1.5: 1 -0.95,0; 2 0.95,0
SWITCH_DPDT_SMD_AYZ0202 = smd 1 x 1.15: 1 -2.5,2.825; 2 0,2.825; 3 2.5,2.825; 4 -2.5,-2.825; 5 0,-2.825; 6 2.5,-2.825 | hole 0.85: 1.5,0; -1.5,0
ALS-PT19-315C = smd 0.8 x 0.8: C -0.75,0; E 0.75,0
SOT23-5 = smd 0.55 x 1.2: 1 -0.95,-1.3; 2 0,-1.3; 3 0.95,-1.3; 4 0.95,1.3; 5 -0.95,1.3
CONN-SMD-2X3 = smd 1.27 x 1.27: P$1 -2.54,-1.27; P$2 -2.54,1.27; P$3 0,-1.27; P$4 0,1.27; P$5 2.54,-1.27; P$6 2.54,1.27
FIDUCIAL_1MM = smd 1 x 1: 1 0,0

### Placement (x,y rotation side)
ADA_MICRO_USB  26.47,53.38 281 top
ATTINY85  48.39,49.59 270 top
BT1  70.27,42.5 0 bottom
BUTTON  112.5,54.09 0 top
C1  29.03,122.09 270 top
C2  87.35,203.16 0 top
C3  87.89,51.04 0 top
C8  86.59,46.98 270 top
C9  94.8,50.38 90 top
C11  92.69,50.38 90 top
CHG  37.96,37.58 90 top
D4  81.33,51.22 0 top
J1  75.26,48.15 90 top
NEO1  7.98,270.63 0 top
NEO2  24.61,236.34 0 top
NEO3  5.95,210.55 0 top
NEO4  14.33,179.31 0 top
NEO5  66.65,205.09 0 top
NEO6  103.1,201.28 0 top
NEO7  126.15,173.98 0 top
NEO8  126.15,139.05 0 top
NEO9  126.15,106.03 0 top
NEO10  126.15,70.47 0 top
NEO11  92.05,38.72 0 top
NEO12  48.36,38.72 0 top
NEO13  15.85,70.47 0 top
NEO14  15.85,106.03 0 top
NEO15  38.71,121.27 0 top
NEO16  95.86,132.7 0 top
OLED  69.19,126.35 0 top
P1  70.18,49.42 270 top
PWR1  101.21,37.32 90 top
R1  14.71,270.12 180 top
R7  26.61,274.35 90 top
R19  37.97,40.1 0 top
R20  81.28,43.68 0 top
R21  33.86,49.52 0 top
R22  33.86,47.11 0 top
R23  33.86,51.93 0 top
R24  101.23,40.12 180 top
R26  89.46,47 270 top
RESET  70.25,38.66 0 top
S1  102.19,49.24 270 top
U1  26.61,281.35 270 top
U2  93.73,45.05 0 top
U3  81.33,47.74 90 top
U$17  34.44,23.97 90 top
U$34  21.44,281.27 0 top
U$35  105.49,8.07 0 top

### Tracks (layer width: path | path; a pad name or v marks a point on that pad's centre or on a via)
+3V3  (via drill 0.35)
  Top 0.508: 91.92,203.16 90.32,204.76 66.66,204.76 64.75,206.68 NEO5.1 64.43,206.84 63.62,207.65 50.59,207.65 46.16,212.08 9.98,212.08 9.18,211.28 2.52,211.28 | 99.51,203.03 101.1,203.03 NEO6.1 | 99.51,203.03 92.05,203.03 91.92,203.16 | U1.C 26.49,282.09 17.76,273.36 6.96,273.36 6.01,272.4 NEO1.1 6.01,272.09 2.19,268.27 2.19,241.9 3.31,240.78 19.79,240.78 21.09,239.48 21.09,237.95 | 21.09,237.95 21.09,236.34 3.95,219.2 NEO3.1 3.79,212.08 2.52,212.08 2.52,211.28 | 21.09,237.95 22.52,237.95 NEO2.1 | 2.52,211.28 2.52,193.98 12.2,184.3 12.2,181.12 NEO4.1 | 35.85,26.66 U$17.P$5 39.55,30.34 46.89,30.34 49.28,32.73 49.28,34.61 48.26,35.62 47.2,35.62 | NEO12.1 46.49,40.31 47.92,40.31 47.92,36.34 47.2,35.62 | C9.1 94.75,49.52 92.85,49.52 C11.1 92.69,46.5 U2.5 92.69,46.18 v92.69,44.91 | 91.58,39.36 91.1,39.36 90.15,40.31 NEO11.1 89.83,40.47 80.46,40.47 v79.83,41.1 | 91.58,39.36 99.51,39.36 100.15,39.99 R24.2 | 91.58,39.36 v91.58,43.8 | 44.18,42.62 40.44,38.88 37.92,38.88 37.92,36.66 38.95,35.62 47.2,35.62 | P1.2 72.84,48.09 73.16,48.09 73.16,43.49 72.37,42.69 44.43,42.69 44.27,42.53 44.18,42.62 | 43.32,52.22 50.94,52.22 51.57,51.58 ATTINY85.8 | 43.32,52.22 35.06,52.22 34.9,52.06 R23.2 35.06,52.38 24.42,63.01 21.2,63.01 16.33,67.89 | 16.33,67.89 16.33,67.77 12.68,67.77 11.88,68.57 11.88,105.67 NEO14.1 | 16.33,67.89 16.33,69.68 13.95,72.06 NEO13.1 | NEO14.1 13.85,116.24 18.28,120.68 29.03,120.68 | 122.69,107.62 122.69,76.82 124.12,75.39 124.12,72.22 NEO10.1 | 122.69,107.62 124.12,107.62 NEO9.1 | 122.69,140.64 124.12,140.64 NEO8.1 | 122.69,140.64 121.9,140.64 | 121.9,140.64 121.87,140.64 121.87,140.62
  Top 0.508: 123.17,174.61 121.9,173.34 121.9,140.64 | 123.17,174.61 124.12,175.57 NEO7.1 | 122.69,140.64 122.69,107.62 | 13.63,107.62 NEO14.1 | 43.32,52.22 v43.32,50.79 | v44.11,42.69 44.18,42.62 | v99.51,202.39 99.51,203.03 | 123.17,174.61 v116.66,181.12 | 121.9,140.64 117.92,136.67 96.17,136.67 93.96,134.45 NEO16.1 93.64,134.29 60.62,134.29 OLED.2 38.71,125.08 36.81,123.18 NEO15.1 35.9,122.97 33.6,120.68 29.03,120.68 | C2.2 91.92,203.16 | C1.2 29.03,120.68
  Bottom 0.508: v91.58,43.8 v92.69,44.91 | v79.83,41.1 72.84,48.09 P1.2 | v44.11,42.69 43.32,43.49 v43.32,50.79 | v99.51,202.39 116.66,185.25 v116.66,181.12
D+
  Top 0.152: ADA_MICRO_USB.D+ 27.28,53.49 28.08,53.49 31.89,49.68 31.89,47.14 32.84,47.14 R22.1
D-
  Top 0.152: ADA_MICRO_USB.D- 27.12,54.12 30.77,54.12 32.84,52.06 R23.1 33,51.9 33,49.52 R21.1
EN
  Top 0.152: S1.2 104.91,49.2 104.91,47.61 104.28,47.61 100.47,43.8 94.75,43.8 U2.3
GND  (via drill 0.35)
  Top 0.254: 94.75,51.58 94.59,51.58 94.59,51.46
  Top 0.508: ADA_MICRO_USB.SPRT@2 27.15,49.48 ADA_MICRO_USB.SPRT@4 24.65,50.12 ADA_MICRO_USB.BASE@2 | ADA_MICRO_USB.SPRT@1 26.48,56.55 ADA_MICRO_USB.SPRT@3 24.36,56.1 ADA_MICRO_USB.BASE@1
  other vias: 16.69,70.85 24.51,52.95 41,47.61 49.38,38.72 92.05,38.22 93.58,42.03 87.99,46.09 84.18,46.09 126.09,69.71 38.71,120 66.73,203.85 24.74,236.34 5.95,210.17 3.66,122.04 67.39,205.55 91.06,54.04 77.83,38.22 87.15,41.85 47.78,49.06 18.85,119.67 67.41,198.06
  pour Top: 0,288.56 140.92,288.56 140.92,-0.01 0,-0.01
  pour Bottom: 0,288.56 140.92,288.56 140.92,-0.04 0,-0.04
N$1
  Top 0.152: NEO13.2 13.79,68.89 13.79,71.27 12.84,71.27 12.49,71.61 12.49,105.13 14.19,106.83 16.96,106.83 17.76,107.62 NEO14.4
N$2
  Top 0.152: NEO12.4 50.46,40.47 51.25,41.26 78.72,41.26 82.84,37.14 89.99,37.14 NEO11.2
N$3  (via drill 0.35)
  Top 0.152: NEO12.2 45.17,37.02 v43.38,38.82 | v28.87,59.84 17.92,70.79 17.92,72.06 NEO13.4
  Bottom 0.152: v43.38,38.82 28.87,53.33 v28.87,59.84
N$4
  Top 0.152: NEO14.2 13.95,104.45 16.01,106.51 21.25,106.51 21.94,107.2 32.08,107.2 34.01,109.13 34.01,119.27 36.81,122.07 39.82,122.07 40.62,122.86 NEO15.4
N$5
  Top 0.152: NEO15.2 36.81,119.69 38.24,121.11 82.05,121.11 94.43,133.5 96.97,133.5 97.77,134.29 NEO16.4
N$8  (via drill 0.35)
  Top 0.152: v61.06,201.8 59.66,200.41 59.66,186.48 44.94,171.76 44.88,171.82 29.47,171.82 25.35,175.93 14.01,175.93 NEO4.2 12.39,177.34 | v66.33,206.52 66.49,206.68 68.56,206.68 NEO5.4
  Bottom 0.152: v66.33,206.52 65.78,206.52 v61.06,201.8
N$9
  Top 0.152: PWR1.A 102.21,37.45 102.21,39.99 R24.1
N$11  (via drill 0.35)
  Top 0.152: v90.62,49.2 91.73,50.31 99.35,50.31 101.42,52.38 104.28,52.38 104.91,51.74 S1.1 | v90.78,47.14 89.83,46.18 89.51,46.18 R26.2
  Bottom 0.152: v90.62,49.2 90.78,49.04 v90.78,47.14
N$12
  Top 0.152: R1.2 13.63,270.18 11.57,272.24 9.98,272.24 NEO1.4
N$13
  Top 0.152: NEO8.2 124.28,137.31 128.25,133.34 128.25,107.78 NEO9.4
N$18
  Top 0.152: 26.49,238.11 NEO2.4 27.69,239.11 27.69,252.46 24.54,255.61 8.99,255.61 6.01,258.59 6.01,268.91 NEO1.2
N$20
  Top 0.152: NEO2.2 21.02,234.64 8.07,221.69 8.07,212.4 NEO3.4
N$21
  Top 0.152: NEO3.2 3.16,208.07 3.16,194.13 16.17,181.12 NEO4.4
N$23  (via drill 0.35)
  Top 0.152: v102.21,200.81 102.14,200.88 99.9,200.88 95.81,196.79 71.3,196.79 64.75,203.35 NEO5.2 | v103.48,202.24 104.12,202.87 105.07,202.87 NEO6.4
  Bottom 0.152: v102.21,200.81 103.48,202.08 v103.48,202.24
N$24
  Top 0.152: NEO6.2 102.73,199.11 117.58,184.26 119.55,184.26 128.09,175.72 NEO7.4
N$25
  Top 0.152: NEO8.4 128.09,140.8 124.28,144.61 124.28,172.23 NEO7.2
N$27
  Top 0.152: NEO10.4 128.15,77.08 124.12,81.12 124.12,104.29 NEO9.2
N$28  (via drill 0.35)
  Top 0.152: v121.26,65.87 124.12,68.73 NEO10.2 | NEO11.4 94.12,40.47 97.13,43.49 103.16,43.49 108.26,48.58 108.26,56.66 112.71,61.11 v116.5,61.11
  Bottom 0.152: v121.26,65.87 v116.5,61.11
PB0_SDA  (via drill 0.35)
  Top 0.152: 35.7,24.12 35.7,24.06 | 35.7,24.06 U$17.P$3 | v45.54,124.29 42.68,121.43 36.67,121.43 34.9,119.66 34.9,108.8 31.42,105.32 30.94,105.32 28.81,103.19 28.81,86.7 30.28,85.23 30.28,73.99 52.21,52.06 72.84,52.06 73.8,51.11 73.8,49.2 71.73,49.2 70.78,48.25 70.3,48.25 P1.4 70.14,48.09 69.03,46.98 52.36,46.98 51.73,47.61 ATTINY85.5 51.57,47.61 49.35,45.39 31.62,45.39 29.82,43.59 29.82,33.59 34.55,28.87 34.55,25.22 35.7,24.06
  Bottom 0.152: v45.54,124.29 OLED.4
PB1_NEO  (via drill 0.35)
  Top 0.152: 31.04,213.06 46.09,213.06 50.83,208.32 87.61,208.32 92.1,203.82 106.18,203.82 130.85,179.15 130.85,69.2 126.25,64.6 86.06,64.6 73.8,52.34 v73.8,52.06 | 31.04,213.06 30.91,213.06 | R1.1 15.69,270.02 28,257.72 28,214.54 29.49,213.04 31.03,213.04 31.04,213.06 | P1.1 71.23,49.2 51.89,49.2 51.73,49.04 ATTINY85.6 51.57,48.88 50.3,48.88 50.3,47.45 48.55,45.71 31.36,45.71 29.38,43.73 29.38,33.43 33.25,29.55 33.25,26.58 U$17.P$6
  Bottom 0.152: v73.8,52.06 72.84,51.11 72.84,50.79 P1.1
PB2_SCL  (via drill 0.35)
  Top 0.152: 31.41,30.06 31.41,29.96 | 31.41,29.96 31.41,25.86 33.16,24.12 U$17.P$4 | 33.79,46.03 48.4,46.03 49.98,47.61 49.98,49.52 | 49.98,49.52 49.98,50.15 51.57,50.15 ATTINY85.7 | OLED.3 49.51,125.72 37.45,125.72 33.81,122.08 15.85,122.08 10.51,116.75 10.51,68.58 13.38,65.71 v15.53,65.71 | v19.03,62.22 19.74,61.5 25.14,61.5 33.79,52.85 33.79,46.03 | 49.98,49.52 69.03,49.52 70.14,50.63 P1.3 | 31.41,29.96 31.37,30 31.37,30.38 28.93,32.82 28.93,44.03 30.93,46.03 33.79,46.03
  Bottom 0.152: v19.03,62.22 v15.53,65.71
PB3_LIGHT_SENSOR  (via drill 0.35)
  Top 0.152: U1.E 26.65,280.5 26.65,275.42 R7.2 26.65,275.26 28.3,273.6 28.3,214.92 29.72,213.5 43.35,213.5 43.71,213.86 v43.73,213.86 | R21.2 34.9,49.52 35.54,50.15 44.9,50.15 ATTINY85.2 45.06,50.31 49.19,50.31 v49.67,50.79 | v59.83,206.68 63.37,203.14 63.37,188.16 64.75,186.78 113.59,186.78 118.6,181.77 120.31,181.77 126.79,175.29 126.79,144.02 128.25,142.55 130.02,140.77 130.02,71.36 129.36,70.7 69.57,70.7 v52.05,53.17
  Bottom 0.152: v59.83,206.68 51.09,206.68 43.91,213.86 v43.73,213.86 | v49.67,50.79 v52.05,53.17 73.54,53.17 74.4,52.31 74.4,51.55 J1.2
PB4_BUTTON2  (via drill 0.35)
  Top 0.152: BUTTON.P$2 115.39,56.03 109.51,56.03 BUTTON.P$1 110.82,54.64 110.82,39.59 106.98,35.75 77.05,35.75 75.03,37.77 v56.97,37.77 | R22.2 34.9,47.14 36.65,48.88 44.9,48.88 ATTINY85.3 45.06,48.88 45.86,48.88 v48.08,46.66 | J1.1 75.26,45.99 v74.22,44.95
  Bottom 0.152: v48.08,46.66 v56.97,37.77 57.89,38.7 73.03,38.7 74.22,39.89 v74.22,44.95 74.22,44.97
PB5_RESET  (via drill 0.35)
  Top 0.152: ATTINY85.1 45.06,51.42 49.98,51.42 50.62,50.79 67.6,50.79 P1.5 | RESET.P$2 73.16,40.63 67.29,40.63 RESET.P$1 67.13,40.47 66.02,40.47 | U$17.P$2 33.31,21.58 34.74,23.01 42.02,23.01 50.67,31.66 50.67,34.86 51.21,35.4 52.05,35.4 57.12,40.47 66.02,40.47 | 66.02,40.47 v66.02,40.63
  Bottom 0.152: v66.02,40.63 66.02,49.04 67.6,50.63 P1.5
PROG
  Top 0.152: U3.5 80.15,46.66 80.15,43.8 80.3,43.8 R20.1
STAT  (via drill 0.35)
  Top 0.152: v73.48,42.69 78.08,47.3 80.78,47.3 80.94,47.14 82.21,47.14 82.53,46.82 U3.1 | v72.37,43.8 71.89,43.33 42.2,43.33 39.03,40.15 R19.2
  Bottom 0.152: v72.37,43.8 v73.48,42.69
STAT_LED
  Top 0.152: CHG.C 36.97,37.61 36.97,39.99 R19.1
VBAT  (via drill 0.35)
  Top 0.508: U3.3 82.53,48.57 81.42,48.57 80.78,47.93 79.19,47.93 78.24,48.88 78.24,52.38 82.05,52.38 83.16,51.26 D4.A 83.32,51.11 86.81,51.11 C3.1 86.97,50.79 87.92,49.84 90.15,49.84 v90.62,50.31
  Bottom 0.508: v90.62,50.31 93.16,47.77 93.16,45.55 102.21,45.55 105.23,42.53 BT1.+
VBUS  (via drill 0.35)
  Top 0.508: 79.99,49.52 79.99,51.11 79.51,51.11 D4.C | 79.99,49.52 79.99,48.72 U3.4 | 85.38,44.76 82.53,41.9 44.59,41.9 40.27,37.58 CHG.A 40.36,37.58 v43.54,40.76 | 85.38,47.77 85.38,44.76 | 85.38,47.77 86.5,47.77 C8.1 86.81,47.93 89.35,47.93 R26.1 | U2.1 92.69,43.8 91.89,44.6 85.54,44.6 85.38,44.76 | 79.99,49.52 83.64,49.52 85.38,47.77 | v29.82,55.74 29,54.92 27.74,54.92 | 27.74,54.92 27.72,54.9 | ADA_MICRO_USB.VBUS 27.1,54.92 27.74,54.92
  Bottom 0.508: v43.54,40.76 38.71,45.58 38.71,53.96 36.93,55.74 v29.82,55.74

### Text on the board
tPlace: ON | BUTTON | OFF | RESET
bPlace: PARTS USED: | ATTINY-85 | 128x32 OLED | CAPACITORS | RESISTORS | FOR DESCRIPTION AND ASSEMBLY INSTRUCTIONS: | BUTTONS | https://github.com/MakeItHackin/Hatch2023Trophy | THIS TROPHY IS HACKABLE. DO SOMETHING FUN WITH IT!!! | SWITCH | TROPHY DESIGNED BY: MakeItHackin | DIODE | LIGHT SENSOR | VOLTAGE REGULATOR | BATTERY CHARGER | NEOPIXEL LEDS | USB CONNECTOR | 01101110 | 01110010 | 01100101 | 01101100 | 00110100 | 01100100 | 01100101 | 01100110 | 01101001 | R29vZCBqb2IgYXQgZGVjb2RpbmcgdGhpcyBtZXNzYWdlIQ== | TROPHY AWARDED TO TEAM/PROJECT:
tStop: GTAG | CATC | 01101000 | 01110101 | 01100100 | 01110011 | 01101111 | 01101110 | GTAA | TTAA | 01100001 | 01101100 | 01110000 | 01101000 | 01100001 | CATT | 01000011 | TGGG | TACG | ATGC | CGTA | TAAT | 01000001 | 01010100 | GATTACACAT | TACG | GTCC | CTAATGTGTA | ATGG | 01010010 | 01000101 | TAGAC | 01001011 | TATA | CGCC | 01000011 | GCGG | 01000001 | ATAT | GAAG | 01001000 | TGTG | TATT | ACAC | 01010011 | ATTA | GTCC | 01010100 | ATTGGGAA | 01000001 | 01010010 | CATG | ATGC | TGGA | GAAG | CGTA | GTAC | GTAC | GATTGACT | GTGG | CGCC | ACCA | ATTAC | ATTA | CACC | TGTCAGGCTA | CATG | TGGA | CACC | GTCC | CATG | TAAT | 01010111 | 01000001 | 01010010 | 01010011 | FOR AN EXTRA CHALLENGE, DECODE THIS TROPHY :)
bStop: ACAC | CATG | GAAG | ATTA | GATTGACT | GTAC | TAGGATC | TGTCAGGCTA | GTAGTA | TGGA | ATCCTAG | TTGTACGA | TGGA | CATG | CGCC | GATTACACAT | CATCATCAT | ATTA | FOR AN EXTRA CHALLENGE, DECODE THIS TROPHY :)